# Altium schematic sheet MIPI_V3x.SCHDOC
size A2
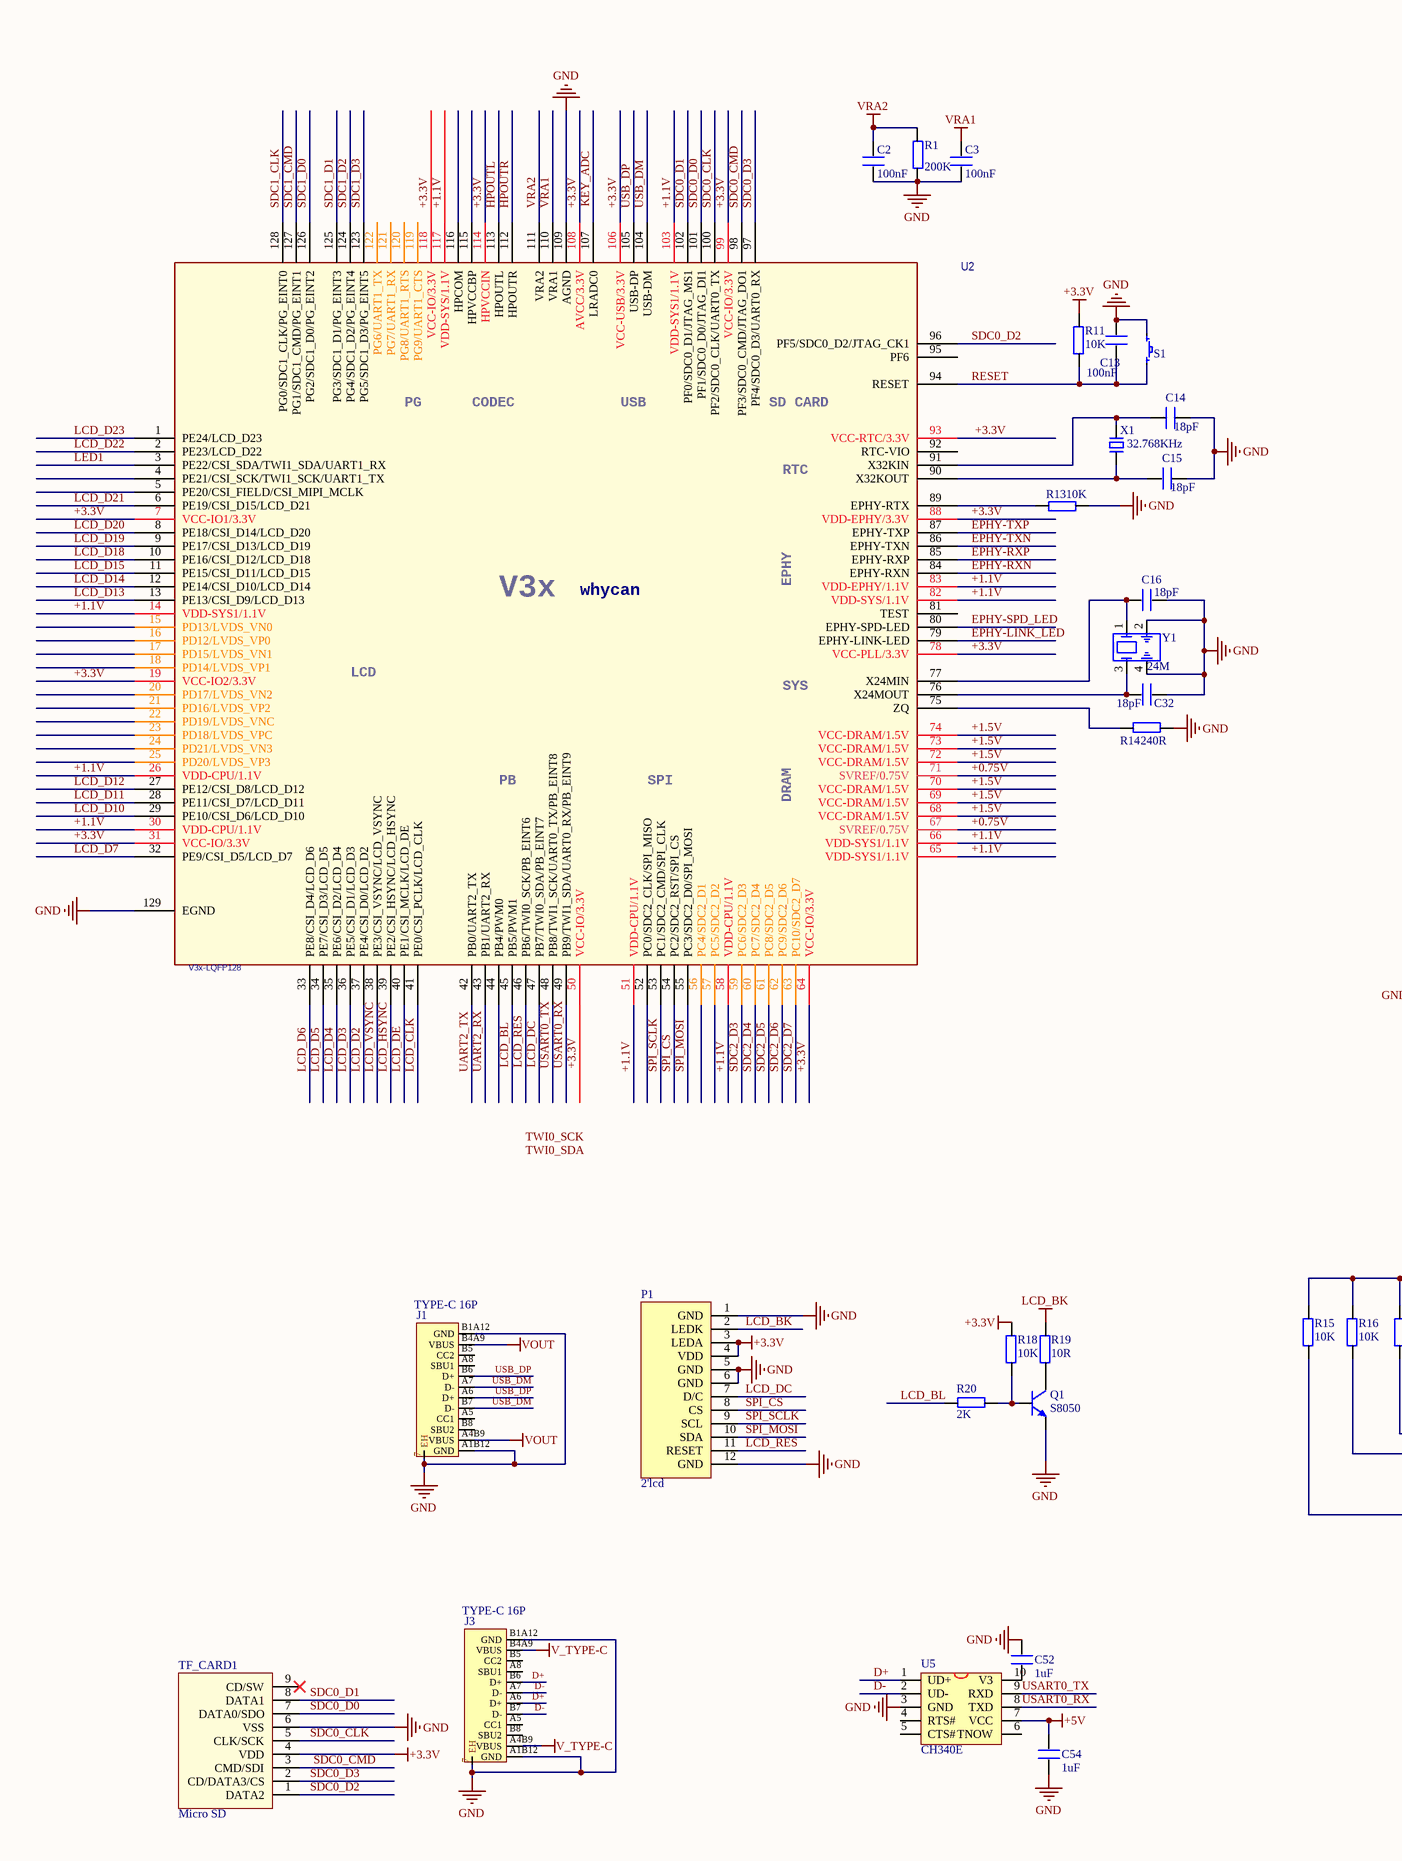
[diagram p0: MIPI_V3x.SCHDOC, left]
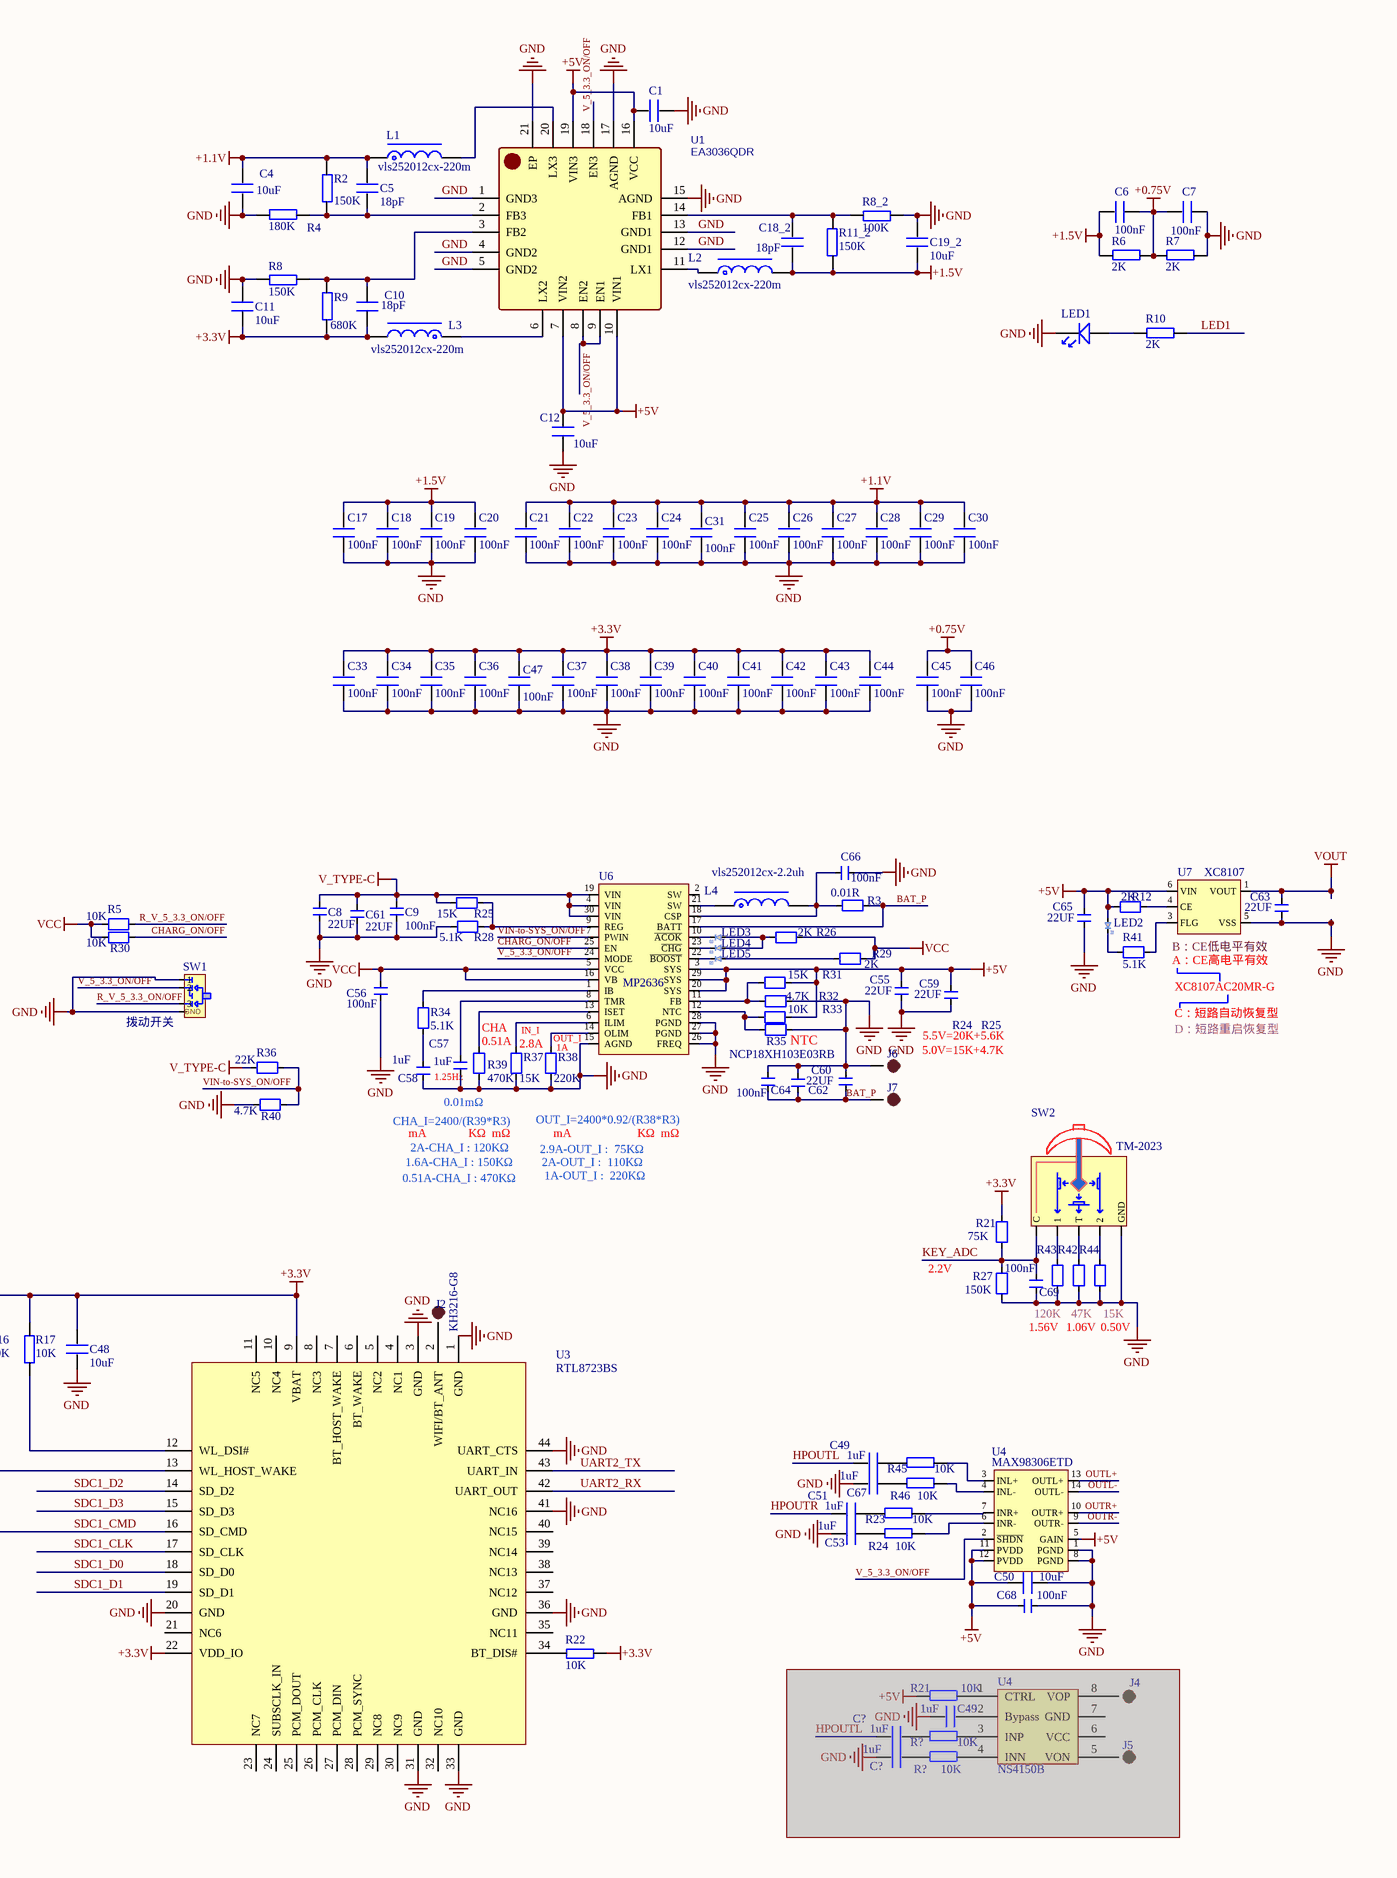
[diagram p1: MIPI_V3x.SCHDOC, right]

## Parts
(Parts that share a designator on the sheet are numbered #1, #2 ... from top to bottom, then left to right.)
C1  10uF  [0603]
C2  100nF  [0402 -]
C3  100nF  [0402 -]
C4  10uF  [0603]
C5  18pF  [0402]
C6  100nF  [0402]
C7  100nF  [0402]
C8  22UF  [0603]
C9  100nF  [0402 -]
C10  18pF  [0402]
C11  10uF  [0603]
C12  10uF  [0603]
C13  100nF  [0402 -]
C14  18pF  [0402 -]
C15  18pF  [0402 -]
C16  18pF  [0402 -]
C17  100nF  [0402 -]
C18  100nF  [0402 -]
C18_2  18pF  [0402]
C19  100nF  [0402 -]
C19_2  10uF  [0603]
C20  100nF  [0402 -]
C21  100nF  [0402 -]
C22  100nF  [0402 -]
C23  100nF  [0402 -]
C24  100nF  [0402 -]
C25  100nF  [0402 -]
C26  100nF  [0402 -]
C27  100nF  [0402 -]
C28  100nF  [0402 -]
C29  100nF  [0402 -]
C30  100nF  [0402 -]
C31  100nF  [0402 -]
C32  18pF  [0402 -]
C33  100nF  [0402 -]
C34  100nF  [0402 -]
C35  100nF  [0402 -]
C36  100nF  [0402 -]
C37  100nF  [0402 -]
C38  100nF  [0402 -]
C39  100nF  [0402 -]
C40  100nF  [0402 -]
C41  100nF  [0402 -]
C42  100nF  [0402 -]
C43  100nF  [0402 -]
C44  100nF  [0402 -]
C45  100nF  [0402 -]
C46  100nF  [0402 -]
C47  100nF  [0402 -]
C48  10uF  [0603]
C49#1  1uF  [0402 -]
C49#2  1uF  [0402 -]  (masked out: inside a compile mask, not in the netlist)
C50  10uF  [0603]
C51  1uF  [0402 -]
C52  1uF  [0402 -]
C53  1uF  [0402 -]
C54  1uF  [0402 -]
C55  22UF  [0603]
C56  100nF  [0402 -]
C57  1uF  [0402 -]
C58  1uF  [0402 -]
C59  22UF  [0603]
C60  22UF  [0603]
C61  22UF  [0603]
C62  22UF  [0603]  (value not drawn)
C63  22UF  [0603]
C64  100nF  [0402 -]
C65  22UF  [0603]
C66  100nF  [0402 -]
C67  1uF  [0402 -]
C68  100nF  [0402 -]
C69  100nF  [0402 -]
C?#1  1uF  [0402 -]  (masked out: inside a compile mask, not in the netlist)
C?#2  1uF  [0402 -]  (masked out: inside a compile mask, not in the netlist)
J1  TYPE-C 16P  [TYPE-C 16P - 2]
J2  KH3216-G8  [ANT-SMD_L3.2-W1.6]
J3  TYPE-C 16P  [TYPE-C 16P - 2]
J4  (no value)  [TP-1.5]  (masked out: inside a compile mask, not in the netlist)
J5  (no value)  [TP-1.5]  (masked out: inside a compile mask, not in the netlist)
J6  (no value)  [TP-1.5]
J7  (no value)  [TP-1.5]
L1  vls252012cx-220m  [L1]
L2  vls252012cx-220m  [L1]
L3  vls252012cx-220m  [L1]
L4  vls252012cx-2.2uh  [0420]
LED1  LED-P  [0603]  (value not drawn)
LED2  LED-R  [0603]  (value not drawn)
LED3  LED-O  [0603]  (value not drawn)
LED4  LED-R  [0603]  (value not drawn)
LED5  LED-B  [0603]  (value not drawn)
P1  2'lcd  [2'LCD]
Q1  S8050  [SOT23-3L]
R1  200K  [0402 -]
R2  150K  [0402 -]
R3  0.01R  [0603]
R4  180K  [0402 -]
R5  10K  [0402 -]
R6  2K  [0402 -]
R7  2K  [0402 -]
R8  150K  [0402 -]
R8_2  100K  [0402 -]
R9  680K  [0402 -]
R10  2K  [0402 -]
R11  10K  [0402 -]
R11_2  150K  [0402 -]
R12  2K  [0402 -]
R13  10K  [0402 -]
R14  240R  [0402 -]
R15  10K  [0402 -]
R16  10K  [0402 -]
R17  10K  [0402 -]
R18  10K  [0402 -]
R19  10R  [0603]
R20  2K  [0402 -]
R21#1  75K  [0402 -]
R21#2  10K  [0402 -]  (masked out: inside a compile mask, not in the netlist)
R22  10K  [0402 -]
R23  10K  [0402 -]
R24  10K  [0402 -]
R25  15K  [0402 -]
R26  2K  [0402 -]
R27  150K  [0402 -]
R28  5.1K  [0402 -]
R29  2K  [0402 -]
R30  10K  [0402 -]
R31  15K  [0402 -]
R32  4.7K  [0402 -]
R33  10K  [0402 -]
R34  5.1K  [0402 -]
R35  NCP18XH103E03RB  [0603]
R36  22K  [0402 -]
R37  15K  [0402 -]
R38  220K  [0402 -]
R39  470K  [0402 -]
R40  4.7K  [0402 -]
R41  5.1K  [0402 -]
R42  47K  [0402 -]
R43  120K  [0402 -]
R44  15K  [0402 -]
R45  10K  [0402 -]
R46  10K  [0402 -]
R?#1  10K  [0402 -]  (masked out: inside a compile mask, not in the netlist)
R?#2  10K  [0402 -]
S1  But-Switch-2  [按键-4]  (value not drawn)
SW1  拨动开关  [拨动开关-5]
SW2  TM-2023  [TM-2023]
TF_CARD1  Micro SD  [Micro SD]
U1  EA3036QDR  [TQFN-20]
U2  V3x-LQFP128  [LQFP-128]
U3  RTL8723BS  [RTL8723BS]
U4#1  MAX98306ETD  [TDFN-14]
U4#2  NS4150B  [MSOP8]  (masked out: inside a compile mask, not in the netlist)
U5  CH340E  [MSOP-10]
U6  MP2636  [QFN-4x4]
U7  XC8107  [SOT23-5L]
X1  32.768KHz  [XT_3215_2]
Y1  24M  [X3225]

## Nets
+0.75V: C6.1 C7.2 C45.1 C46.1 R6.1 R7.2 U2.67(SVREF/0.75V) U2.71(SVREF/0.75V)
+1.1V: C4.2 C5.2 C21.1 C22.1 C23.1 C24.1 C25.1 C26.1 C27.1 C28.1 C29.1 C30.1 C31.1 L1.1 R2.2 U2.14(VDD-SYS1/1.1V) U2.26(VDD-CPU/1.1V) U2.30(VDD-CPU/1.1V) U2.51(VDD-CPU/1.1V) U2.58(VDD-CPU/1.1V) U2.65(VDD-SYS1/1.1V) U2.66(VDD-SYS1/1.1V) U2.82(VDD-SYS/1.1V) U2.83(VDD-EPHY/1.1V) U2.103(VDD-SYS1/1.1V) U2.117(VDD-SYS/1.1V)
+1.5V: C6.2 C17.1 C18.1 C18_2.2 C19.1 C19_2.2 C20.1 L2.2 R6.2 R11_2.2 U2.68(VCC-DRAM/1.5V) U2.69(VCC-DRAM/1.5V) U2.70(VCC-DRAM/1.5V) U2.72(VCC-DRAM/1.5V) U2.73(VCC-DRAM/1.5V) U2.74(VCC-DRAM/1.5V)
+3.3V: C10.2 C11.2 C33.1 C34.1 C35.1 C36.1 C37.1 C38.1 C39.1 C40.1 C41.1 C42.1 C43.1 C44.1 C47.1 C48.1 L3.2 P1.3(LEDA) P1.4(VDD) R9.2 R11.1 R15.1 R16.1 R17.1 R18.1 R21#1.1 R22.2 TF_CARD1.4(VDD) U2.7(VCC-IO1/3.3V) U2.19(VCC-IO2/3.3V) U2.31(VCC-IO/3.3V) U2.50(VCC-IO/3.3V) U2.64(VCC-IO/3.3V) U2.78(VCC-PLL/3.3V) U2.88(VDD-EPHY/3.3V) U2.93(VCC-RTC/3.3V) U2.99(VCC-IO/3.3V) U2.106(VCC-USB/3.3V) U2.108(AVCC/3.3V) U2.114(HPVCCIN) U2.118(VCC-IO/3.3V) U3.9(VBAT) U3.22(VDD_IO)
+5V: C1.2 C12.2 C50.2 C54.2 C55.2 C59.2 C65.2 C68.2 LED2.1 R12.1 R31.1 R33.1 U1.7(VIN2) U1.10(VIN1) U1.16(VCC) U1.19(VIN3) U4#1.5(GAIN) U4#1.11(PVDD) U4#1.12(PVDD) U5.7(VCC) U6.3(SYS) U6.20(SYS) U6.29(SYS) U7.6(VIN)
GND: C1.1 C2.1 C3.1 C4.1 C7.1 C8.1 C9.1 C11.1 C12.1 C13.1 C14.2 C15.2 C16.2 C17.2 C18.2 C19.2 C19_2.1 C20.2 C21.2 C22.2 C23.2 C24.2 C25.2 C26.2 C27.2 C28.2 C29.2 C30.2 C31.2 C32.2 C33.2 C34.2 C35.2 C36.2 C37.2 C38.2 C39.2 C40.2 C41.2 C42.2 C43.2 C44.2 C45.2 C46.2 C47.2 C48.2 C50.1 C52.2 C53.2 C54.1 C55.1 C56.1 C57.1 C58.1 C59.1 C60.2 C61.1 C62.2 C63.1 C64.2 C65.1 C66.2 C67.2 C68.1 C69.1 J1.7(EH) J1.A1B12(GND) J1.B1A12(GND) J3.7(EH) J3.A1B12(GND) J3.B1A12(GND) J6.1 LED1.2 P1.1(GND) P1.5(GND) P1.6(GND) P1.12(GND) Q1.2(E) R1.1 R4.2 R7.1 R8.2 R8_2.2 R13.2 R14.1 R27.2 R28.1 R32.2 R35.1 R37.1 R38.1 R39.1 R40.2 R42.2 R43.2 R44.2 S1.1 SW1.1 SW1.4 SW2.GND TF_CARD1.6(VSS) U1.1(GND3) U1.4(GND2) U1.5(GND2) U1.12(GND1) U1.13(GND1) U1.15(AGND) U1.17(AGND) U1.21(EP) U2.109(AGND) U2.129(EGND) U3.1(GND) U3.3(GND) U3.20(GND) U3.31(GND) U3.33(GND) U3.36(GND) U3.41(NC16) U3.44(UART_CTS) U4#1.1(PGND) U4#1.8(PGND) U5.3(GND) U6.15(AGND) U6.26(FREQ) U6.27(PGND) U6.28(PGND) U7.5(VSS) Y1.2(GND) Y1.4(GND)
LCD_BK: P1.2(LEDK) R19.1
V_TYPE-C: C8.2 C9.2 C61.2 J3.A4B9(VBUS) J3.B4A9(VBUS) R25.2 R36.1 U6.4(VIN) U6.19(VIN) U6.30(VIN)
VCC: C56.2 R5.1 R26.2 R29.2 R30.1 U6.5(VCC) U6.16(VB)
VOUT: C63.2 J1.A4B9(VBUS) J1.B4A9(VBUS) U7.1(VOUT)
VRA1: C3.2 U2.110(VRA1)
VRA2: C2.2 R1.2 U2.111(VRA2)
BAT_P: C60.1 C62.1 C64.1 J7.1 R3.2 U6.17(BATT)
CHARG_ON/OFF: R30.2 U6.25(EN)
D+: J3.A6(D+) J3.B6(D+) U5.1(UD+)
D-: J3.A7(D-) J3.B7(D-) U5.2(UD-)
EPHY-LINK_LED: U2.79(EPHY-LINK-LED)
EPHY-RXN: U2.84(EPHY-RXN)
EPHY-RXP: U2.85(EPHY-RXP)
EPHY-SPD_LED: U2.80(EPHY-SPD-LED)
EPHY-TXN: U2.86(EPHY-TXN)
EPHY-TXP: U2.87(EPHY-TXP)
HPOUTL: C49#1.2 U2.113(HPOUTL)
HPOUTR: C51.2 U2.112(HPOUTR)
KEY_ADC: C69.2 R21#1.2 R27.1 SW2.C U2.107(LRADC0)
LCD_BL: R20.2 U2.45(PB5/PWM1)
LCD_CLK: U2.41(PE0/CSI_PCLK/LCD_CLK)
LCD_D2: U2.37(PE4/CSI_D0/LCD_D2)
LCD_D3: U2.36(PE5/CSI_D1/LCD_D3)
LCD_D4: U2.35(PE6/CSI_D2/LCD_D4)
LCD_D5: U2.34(PE7/CSI_D3/LCD_D5)
LCD_D6: U2.33(PE8/CSI_D4/LCD_D6)
LCD_D7: U2.32(PE9/CSI_D5/LCD_D7)
LCD_D10: U2.29(PE10/CSI_D6/LCD_D10)
LCD_D11: U2.28(PE11/CSI_D7/LCD_D11)
LCD_D12: U2.27(PE12/CSI_D8/LCD_D12)
LCD_D13: U2.13(PE13/CSI_D9/LCD_D13)
LCD_D14: U2.12(PE14/CSI_D10/LCD_D14)
LCD_D15: U2.11(PE15/CSI_D11/LCD_D15)
LCD_D18: U2.10(PE16/CSI_D12/LCD_D18)
LCD_D19: U2.9(PE17/CSI_D13/LCD_D19)
LCD_D20: U2.8(PE18/CSI_D14/LCD_D20)
LCD_D21: U2.6(PE19/CSI_D15/LCD_D21)
LCD_D22: U2.2(PE23/LCD_D22)
LCD_D23: U2.1(PE24/LCD_D23)
LCD_DC: P1.7(D/C) U2.47(PB7/TWI0_SDA/PB_EINT7)
LCD_DE: U2.40(PE1/CSI_MCLK/LCD_DE)
LCD_HSYNC: U2.39(PE2/CSI_HSYNC/LCD_HSYNC)
LCD_RES: P1.11(RESET) U2.46(PB6/TWI0_SCK/PB_EINT6)
LCD_VSYNC: U2.38(PE3/CSI_VSYNC/LCD_VSYNC)
LED1: R10.1 U2.3(PE22/CSI_SDA/TWI1_SDA/UART1_RX)
OUTL+: U4#1.13(OUTL+)
OUTL-: U4#1.14(OUTL-)
OUTR+: U4#1.10(OUTR+)
OUTR-: U4#1.9(OUTR-)
R_V_5_3.3_ON/OFF: R5.2 SW1.3
RESET: C13.2 R11.2 S1.2 U2.94(RESET)
SDC0_CLK: TF_CARD1.5(CLK/SCK) U2.100(PF2/SDC0_CLK/UART0_TX)
SDC0_CMD: TF_CARD1.3(CMD/SDI) U2.98(PF3/SDC0_CMD/JTAG_DO1)
SDC0_D0: TF_CARD1.7(DATA0/SDO) U2.101(PF1/SDC0_D0/JTAG_DI1)
SDC0_D1: TF_CARD1.8(DATA1) U2.102(PF0/SDC0_D1/JTAG_MS1)
SDC0_D2: TF_CARD1.1(DATA2) U2.96(PF5/SDC0_D2/JTAG_CK1)
SDC0_D3: TF_CARD1.2(CD/DATA3/CS) U2.97(PF4/SDC0_D3/UART0_RX)
SDC1_CLK: U2.128(PG0/SDC1_CLK/PG_EINT0) U3.17(SD_CLK)
SDC1_CMD: R15.2 U2.127(PG1/SDC1_CMD/PG_EINT1) U3.16(SD_CMD)
SDC1_D0: U2.126(PG2/SDC1_D0/PG_EINT2) U3.18(SD_D0)
SDC1_D1: U2.125(PG3/SDC1_D1/PG_EINT3) U3.19(SD_D1)
SDC1_D2: U2.124(PG4/SDC1_D2/PG_EINT4) U3.14(SD_D2)
SDC1_D3: U2.123(PG5/SDC1_D3/PG_EINT5) U3.15(SD_D3)
SDC2_D3: U2.59(PC6/SDC2_D3)
SDC2_D4: U2.60(PC7/SDC2_D4)
SDC2_D5: U2.61(PC8/SDC2_D5)
SDC2_D6: U2.62(PC9/SDC2_D6)
SDC2_D7: U2.63(PC10/SDC2_D7)
SPI_CS: P1.8(CS) U2.54(PC2/SDC2_RST/SPI_CS)
SPI_MOSI: P1.10(SDA) U2.55(PC3/SDC2_D0/SPI_MOSI)
SPI_SCLK: P1.9(SCL) U2.53(PC1/SDC2_CMD/SPI_CLK)
UART2_RX: U2.43(PB1/UART2_RX) U3.42(UART_OUT)
UART2_TX: U2.42(PB0/UART2_TX) U3.43(UART_IN)
USART0_RX: U2.49(PB9/TWI1_SDA/UART0_RX/PB_EINT9) U5.8(TXD)
USART0_TX: U2.48(PB8/TWI1_SCK/UART0_TX/PB_EINT8) U5.9(RXD)
USB_DM: J1.A7(D-) J1.B7(D-) U2.104(USB-DM)
USB_DP: J1.A6(D+) J1.B6(D+) U2.105(USB-DP)
V_5_3.3_ON/OFF: SW1.2 U1.8(EN2) U1.9(EN1) U1.18(EN3) U4#1.2(~{SHDN}) U6.24(MODE)
VIN-to-SYS_ON/OFF: R36.2 R40.1 U6.7(PWIN)
NetC5_1: C5.1 R2.1 R4.1 U1.2(FB3)
NetC10_1: C10.1 R8.1 R9.1 U1.3(FB2)
NetC14_1: C14.1 U2.91(X32KIN) X1.2
NetC15_1: C15.1 U2.90(X32KOUT) X1.1
NetC16_1: C16.1 U2.77(X24MIN) Y1.1(OSC1)
NetC18_2_1: C18_2.1 R8_2.1 R11_2.1 U1.14(FB1)
NetC32_1: C32.1 U2.76(X24MOUT) Y1.3(OSC2)
NetC49#1_1: C49#1.1 R45.2
NetC51_1: C51.1 R23.2
NetC52_1: C52.1 U5.10(V3)
NetC53_1: C53.1 R24.2
NetC57_2: C57.2 U6.8(TMR)
NetC58_2: C58.2 R34.1
NetC66_1: C66.1 L4.2 R3.1 U6.18(CSP)
NetC67_1: C67.1 R46.2
NetJ2_1: J2.1 U3.2(WIFI/BT_ANT)
NetL1_2: L1.2 U1.20(LX3)
NetL2_1: L2.1 U1.11(LX1)
NetL3_1: L3.1 U1.6(LX2)
NetL4_1: L4.1 U6.21(SW)
NetLED1_1: LED1.1 R10.2
NetLED2_2: LED2.2 R41.2
NetLED3_1: LED3.1 LED4.1 R26.1
NetLED3_2: LED3.2 U6.10(~{ACOK})
NetLED4_2: LED4.2 U6.23(~{CHG})
NetLED5_1: LED5.1 R29.1
NetLED5_2: LED5.2 U6.22(~{BOOST})
NetQ1_1: Q1.1(B) R18.2 R20.1
NetQ1_3: Q1.3(C) R19.2
NetR12_2: R12.2 U7.4(CE)
NetR13_1: R13.1 U2.89(EPHY-RTX)
NetR14_2: R14.2 U2.75(ZQ)
NetR16_2: R16.2 U3.13(WL_HOST_WAKE)
NetR17_2: R17.2 U3.12(WL_DSI#)
NetR22_1: R22.1 U3.34(BT_DIS#)
NetR23_1: R23.1 U4#1.7(INR+)
NetR24_1: R24.1 U4#1.6(INR-)
NetR25_1: R25.1 R28.2 U6.9(REG)
NetR31_2: R31.2 R32.1 U6.11(FB)
NetR33_2: R33.2 R35.2 U6.12(NTC)
NetR34_2: R34.2 U6.1(IB)
NetR37_2: R37.2 U6.6(ILIM)
NetR38_2: R38.2 U6.14(OLIM)
NetR39_2: R39.2 U6.13(ISET)
NetR41_1: R41.1 U7.3(FLG)
NetR42_1: R42.1 SW2.T
NetR43_1: R43.1 SW2.1
NetR44_1: R44.1 SW2.2
NetR45_1: R45.1 U4#1.3(INL+)
NetR46_1: R46.1 U4#1.4(INL-)

Not connected (* = marked no-connect by the designer): J1 A5(CC1) A8(SBU1) B5(CC2) B8(SBU2); J3 A5(CC1) A8(SBU1) B5(CC2) B8(SBU2); R?#2 1 2; TF_CARD1 9(CD/SW)*; U2 4(PE21/CSI_SCK/TWI1_SCK/UART1_TX) 5(PE20/CSI_FIELD/CSI_MIPI_MCLK) 15(PD13/LVDS_VN0) 16(PD12/LVDS_VP0) 17(PD15/LVDS_VN1) 18(PD14/LVDS_VP1) 20(PD17/LVDS_VN2) 21(PD16/LVDS_VP2) 22(PD19/LVDS_VNC) 23(PD18/LVDS_VPC) 24(PD21/LVDS_VN3) 25(PD20/LVDS_VP3) 44(PB4/PWM0) 52(PC0/SDC2_CLK/SPI_MISO) 56(PC4/SDC2_D1) 57(PC5/SDC2_D2) 81(TEST) 92(RTC-VIO) 95(PF6) 115(HPVCCBP) 116(HPCOM) 119(PG9/UART1_CTS) 120(PG8/UART1_RTS) 121(PG7/UART1_RX) 122(PG6/UART1_TX); U3 4(NC1) 5(NC2) 6(BT_WAKE) 7(BT_HOST_WAKE) 8(NC3) 10(NC4) 11(NC5) 21(NC6) 23(NC7) 24(SUBSCLK_IN) 25(PCM_DOUT) 26(PCM_CLK) 27(PCM_DIN) 28(PCM_SYNC) 29(NC8) 30(NC9) 32(NC10) 35(NC11) 37(NC12) 38(NC13) 39(NC14) 40(NC15); U5 4(RTS#) 5(CTS#) 6(TNOW); U6 2(SW)

## Notes on the sheet
- A：CE高电平有效
- B：CE低电平有效
- 0.51A
- CHA
- 2.8A
- IN_I
- (near R38) OUT_I
- (near R35) NTC
- 5.5V=20K+5.6K
- (near C59) R24
- (near C59) R25
- XC8107AC20MR-G
- C：短路自动恢复型
- D：短路重启恢复型
- (near C57) 1.25Hz
- 0.01mΩ
- (near R38) 1A
- OUT_I=2400*0.92/(R38*R3)
- 5.0V=15K+4.7K
- CHA_I=2400/(R39*R3)
- 1.6A-CHA_I : 150KΩ
- mA              KΩ  mΩ
- 0.51A-CHA_I : 470KΩ
- 2A-CHA_I : 120KΩ
- 2.9A-OUT_I :  75KΩ
- 2A-OUT_I :  110KΩ
- 1A-OUT_I :  220KΩ
- mA                      KΩ  mΩ
- 2.2V
- 1.56V
- 1.06V
- 0.50V
- Labels drawn without touching a wire or pin: TWI0_SCK, TWI0_SDA
- (in symbol V3x-LQFP128) PG; CODEC; USB; SD CARD; RTC; EPHY; whycan; V3x; LCD; SYS; PB; SPI; DRAM
- (in symbol 拨动开关) GND

## Library data of the parts
C1-C7 C10-C18 C18_2 C19 C19_2 C20-C48 C49#1 C49#2 C50-C54 C67 C?#1 C?#2 = C
C8 C9 C55-C66 C68 C69 = C: 无极性贴片电容; 版权归属: 源创客; BOM名称: 无极性贴片电容; 学习资源: www.ooocke.com
J1 J3 = TYPE-C 16P: TYPE-C接口 16P
J2 J4-J7 = TEST-POINT: 测试点
L1-L4 = L-CDRH: 功率屏蔽电感; 版权归属: 源创客; BOM名称: 功率屏蔽电感; 学习资源: www.ooocke.com
LED1 = LED
LED2-LED5 = LED: 发光二极管
Q1 = 8050-SMD: 高频放大-NPN型; BOM名称: 高频放大-PNP型; 版权归属: 源创客; 属性: 40V 1.5A 1W 100MHZ; 学习资源: www.ooocke.com
R1 R2 R4 R6-R8 R8_2 R9-R11 R11_2 R13-R20 R21#2 R22-R24 R45 R46 R?#1 R?#2 = R
R3 R5 R12 R21#1 R25-R44 = R: 贴片电阻; 版权归属: 源创客; BOM名称: 贴片电阻; 学习资源: www.ooocke.com
S1 = But-Switch-2: 按键开关
SW1 = 拨动开关: SMD拨动开关
SW2 = TM-2023: 3挡小拨轮开关
TF_CARD1 = Micro SD: Micro SD卡; 版权归属: 源创客; BOM名称: Micro SD卡; 学习资源: www.ooocke.com
U1 = EA3036QDR: BOM_Manufacturer: Everanalog; spicePre: X; BOM_Manufacturer Part: EA3036QDR; BOM_Supplier: LCSC; BOM_Supplier Part: C111587
U2 = V3x-LQFP128: Allwinner V3S SoC
U4#1 = MAX98306ETD: D类功放芯片
U5 = CH340E: USB2UART
U6 = MP2636: 电池充电+路径管理+升压输出
U7 = XC8107: 防止倒流芯片; pin to pad: 5>2 6>5
X1 = XTAL-2P: 2脚无源晶振; BOM名称: 2脚晶振; 版权归属: 源创客; 学习资源: www.ooocke.com
Y1 = SMD XTAL